# Altium schematic sheet Sheet5_PowerSupply&Connecters.SchDoc: Power Supply & Connectors
size A4; DrawnBy: D.N.Nhuan; Revision: NT-1.1; SheetNumber: 5; SheetTotal: 5
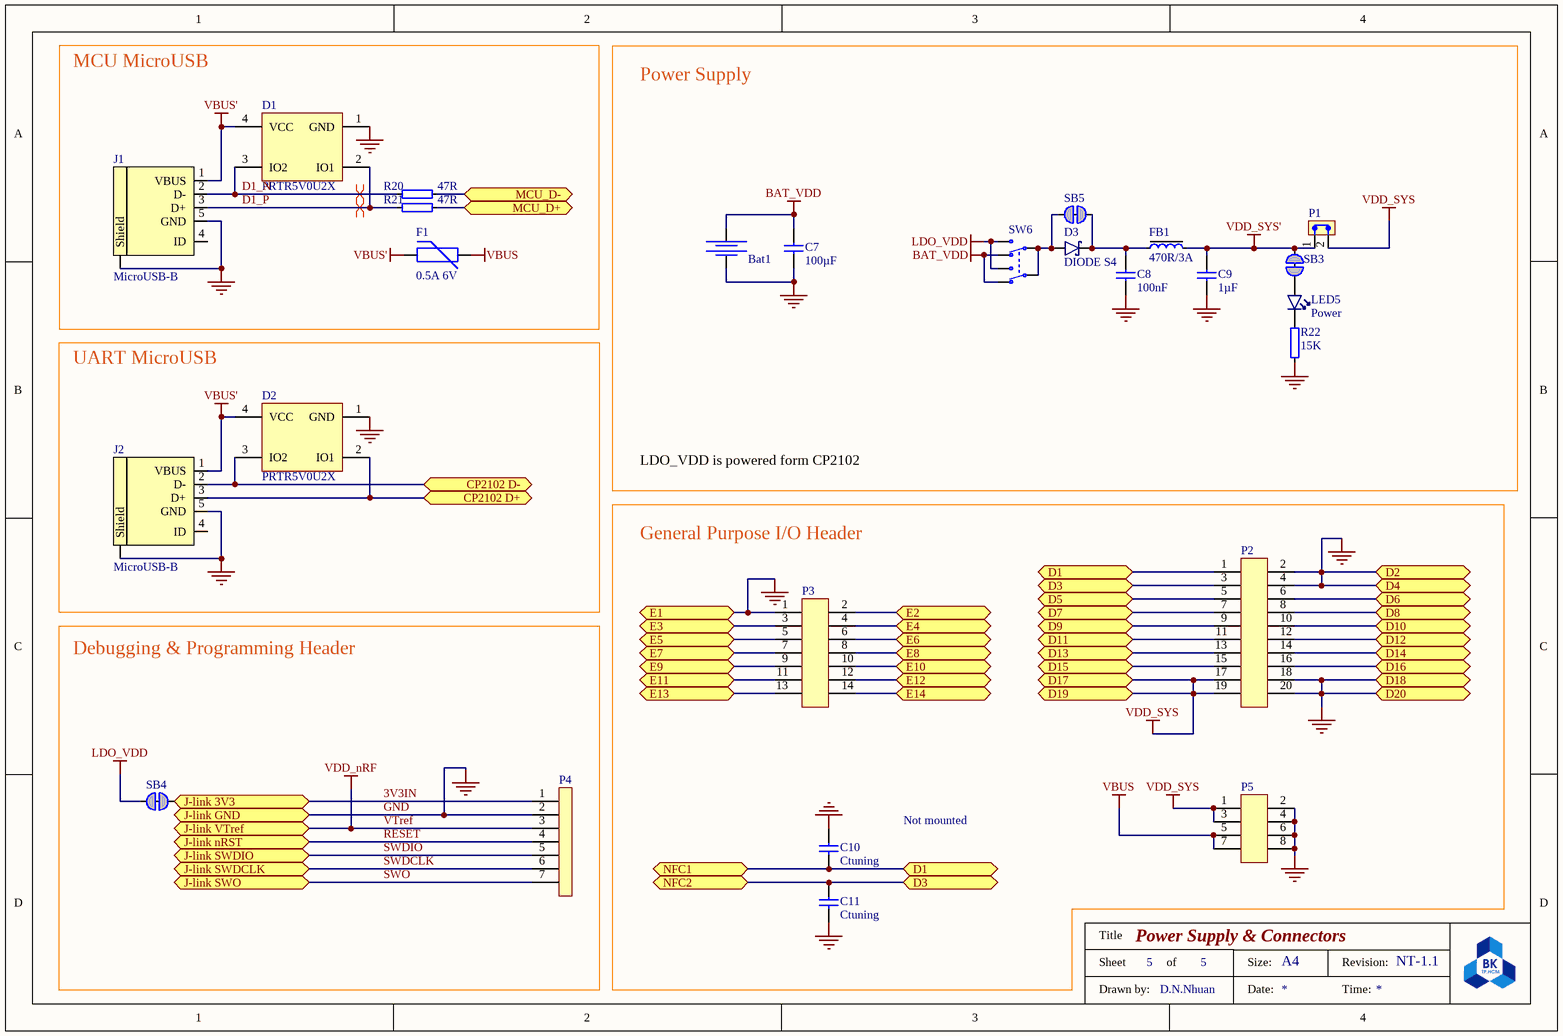
[diagram p0: Sheet5_PowerSupply&Connecters.SchDoc]

## Parts
Bat1  Bat Holder CR2032  [CR2032_HOLDER]  (value not drawn)
C7  100µF  [1210_Imperial]
C8  100nF  [0402 imperial]
C9  1µF  [0603_Imperial]
C10  Ctuning  [0402 imperial]
C11  Ctuning  [0402 imperial]
D1  PRTR5V0U2X  [SOT190P230X110-4L]
D2  PRTR5V0U2X  [SOT190P230X110-4L]
D3  DIODE S4  [SOD-123]
F1  0.5A 6V  [0805_Imperial]
FB1  470R/3A  [0603_Imperial]
J1  MicroUSB-B  [USB-Micro-B-RA-SMD-PiP]
J2  MicroUSB-B  [USB-Micro-B-RA-SMD-PiP]
LED5  Power  [LED_0603]
P1  2p, 2.54mm  [CONN2.54MM2P]  (value not drawn)
P2  10x2, 2.54mm  [CONN2.54MM10X2]  (value not drawn)
P3  2x7p, 2.54mm  [CONN2.54MM7PX2]  (value not drawn)
P4  Debug&Programming  [CONN2.54MM7P]  (value not drawn)
P5  2x4p, 2.54mm  [CONN2.54MM2X4]  (value not drawn)
R20  47R  [0402 imperial]
R21  47R  [0402 imperial]
R22  15K  [0402 imperial]
SB3  Solderbridge  [Solderbridge_Shorted]  (value not drawn)  (net tie, no BOM)
SB4  Solderbridge  [Solderbridge_Shorted]  (value not drawn)  (net tie, no BOM)
SB5  Solderbridge  [Solderbridge_Shorted]  (value not drawn)  (net tie, no BOM)
SW6  MSS22D18  [MSS22D18SMD]  (value not drawn)

## Blocks framed on the sheet
MCU MicroUSB: D1 F1 J1 R20 R21
Power Supply: Bat1 C7-C9 D3 FB1 LED5 P1 R22 SB3 SB5 SW6
UART MicroUSB: D2 J2
General Purpose I/O Header: C10 C11 P2 P3 P5
Debugging & Programming Header: P4 SB4

## Ports
CP2102 D+, CP2102 D-, D1, D2, D3, D4, D5, D6, D7, D8, D9, D10, D11, D12, D13, D14, D15, D16, D17, D18, D19, D20, E1, E2, E3, E4, E5, E6, E7, E8, E9, E10, E11, E12, E13, E14, J-link 3V3, J-link GND, J-link nRST, J-link SWDCLK, J-link SWDIO, J-link SWO, J-link VTref, MCU_D+, MCU_D-, NFC1, NFC2

## Nets
BAT_VDD: Bat1.1 C7.2 SW6.3(N.C-1) SW6.6(N.C-2)
GND: Bat1.2 C7.1 C8.1 C9.1 C10.2 C11.1 D1.1(GND) D2.1(GND) J1.5(GND) J1.6(Shield) J2.5(GND) J2.6(Shield) P2.2 P2.4 P2.18 P2.20 P3.1 P4.2 P5.2 P5.4 P5.6 P5.8 R22.1 ; port J-link GND, port D2, port D4, port D18, port D20, port E1
LDO_VDD: SB4.1 SW6.1(N.O-1) SW6.4(N.O-2)
VBUS: F1.2 P5.5 P5.7
VBUS': D1.4(VCC) D2.4(VCC) F1.1 J1.1(VBUS) J2.1(VBUS)
VDD_SYS: P1.2 P2.17 P2.19 P5.1 P5.3 ; port D17, port D19
VDD_SYS': C9.2 FB1.2 P1.1 SB3.1
VTref: P4.3 ; port J-link VTref  [also labelled VDD_nRF]
3V3IN: P4.1 SB4.2 ; port J-link 3V3
CP2102 D+: D2.2(IO1) J2.3(D+) ; port CP2102 D+
CP2102 D-: D2.3(IO2) J2.2(D-) ; port CP2102 D-
D1: C10.1 P2.1 ; port D1, port NFC1
D1_N: D1.3(IO2) J1.2(D-) R20.1
D1_P: D1.2(IO1) J1.3(D+) R21.1
D3: C11.2 P2.3 ; port D3, port NFC2
D5: P2.5 ; port D5
D6: P2.6 ; port D6
D7: P2.7 ; port D7
D8: P2.8 ; port D8
D9: P2.9 ; port D9
D10: P2.10 ; port D10
D11: P2.11 ; port D11
D12: P2.12 ; port D12
D13: P2.13 ; port D13
D14: P2.14 ; port D14
D15: P2.15 ; port D15
D16: P2.16 ; port D16
E2: P3.2 ; port E2
E3: P3.3 ; port E3
E4: P3.4 ; port E4
E5: P3.5 ; port E5
E6: P3.6 ; port E6
E7: P3.7 ; port E7
E8: P3.8 ; port E8
E9: P3.9 ; port E9
E10: P3.10 ; port E10
E11: P3.11 ; port E11
E12: P3.12 ; port E12
E13: P3.13 ; port E13
E14: P3.14 ; port E14
MCU_D+: R21.2 ; port MCU_D+
MCU_D-: R20.2 ; port MCU_D-
RESET: P4.4 ; port J-link nRST
SWDCLK: P4.6 ; port J-link SWDCLK
SWDIO: P4.5 ; port J-link SWDIO
SWO: P4.7 ; port J-link SWO
NetC8_2: C8.2 D3.1(C) FB1.1 SB5.1
NetD3_2: D3.2(A) SB5.2 SW6.2(COM-1) SW6.5(COM-2)
NetLED5_1: LED5.1(C) R22.2
NetLED5_2: LED5.2(A) SB3.2

Not connected (* = marked no-connect by the designer): J1 4(ID); J2 4(ID)

## Layout directives
differential pair: D1_N, D1_P

## Notes on the sheet
- LDO_VDD is powered form CP2102
- Not mounted
- Title
- Sheet
- of
- Size:
- A4
- Revision:
- Drawn by:
- Date:
- Time:

## Library data of the parts
Bat1 = Bat Holder CR2032: Bat Holder CR2032 SMD; Note: Bat Holder CR2032
C7-C11 = Capacitor: Genaral Schematic; Tolerance: ±5%; Suppiler: *; Link of Supplier: *; Manufacturer: *; Manufacturer Part Number: *; Footprint: 0402
  C7: Value: 100µF
  C8: Value: 100nF
  C9: Value: 1µF
  C10 C11: Value: Ctuning
D1 D2 = PRTR5V0U2X: Ultra low capacitance double rail-to-rail ESD protection diode; Manufacturer: NXP; 2nd source part number: 152-4157; Artikkelnr Noca: 10069015; Artikkelnr Simpro: N.A.; Part Number: PRTR5V0U2X; Manufacturer Part Number: PRTR5V0U2X; Datasheet: http://www.farnell.com/datasheets/109718.pdf; LatestRevisionDate: 2012-06-11; Publisher: Nordic Semiconductor; Published: 2012-06-11; Value: PRTR5V0U2X; Note: *; Supplier: Digi-Key; Supplier part number: 568-4140-1-ND; 2nd source Supplier: Farnell; Footprint Doc: SOT-143B
D3 = Diode Schottky: Value: DIODE S4; Note: *
F1 = Fuse: Fuse Fuse Fuse; Value: 0.5A 6V
FB1 = Ferrite Bead: General FB; Footprint: 0603; Value: 470R/3A
J1 J2 = MiniUSB-AB-SMT: MicroUSB-B-SMT; Manufacturer: Allen Creations Corp.; Manufacturer Part Number: AJU55-BS2111-L; 2nd source part number: 609-4616-1-ND; Part number IPS: 00000007790; Artikkelnr Noca: 55029020; Artikkelnr Simpro: N.A.; Part Number: USB-Micro-B-RA-SMD-PiP; Datasheet: \\hizz\pro\app9717\Datasheet\connectores\Allen Creations Corp\AJU-211.pdf; Footprint Doc: USB-Micro-B-RA-SMD-PiP; LatestRevisionDate: 2016-04-21; Pin Count: 5; Publisher: Nordic Semiconductor; Published: 2014-10-07; Value: MicroUSB-B; Note: *; Supplier: Cabcon; Supplier part number: AJU55-BS2111-L; 2nd source Supplier: Digi-Key
LED5 = LED: General Schematic; Color: Green; Footprint: 0603; Indicate: Power
P1 = Headerx 2: Value: 2p, 2.54mm
P2 = Header 10x2: General Schematic; Value: 10x2, 2.54mm
P3 = Header 7x2: General Schematic; Value: 2x7p, 2.54mm
P4 = Header 7: General Schematic; Value: Debug&Programming
P5 = Header 4x2: General Schematic; Value: 2x4p, 2.54mm
R20-R22 = Resistor: General Schematic; Tolerance: ±5%; Supplier: *; Link of Supplier: *; Footprint: 0402
  R20 R21: Value: 47R
  R22: Value: 15K
SB3-SB5 = Solderbridge Shorted: Shorted Solderbridge; Artikkelnr Noca: N.A.; Part Number: Solderbridge Shorted; Manufacturer: *; Manufacturer Part Number: *; Datasheet: *; LatestRevisionDate: 2012-08-07; Pin Count: 2; Publisher: Nordic Semiconductor; Published: 2012-08-07; Value: Solderbridge; Note: *; Supplier: *; Supplier part number: *; 2nd source Supplier: *; 2nd source part number: *; Footprint Doc: Solderbridge_Shorted; Artikkelnr Simpro: N.A.
SW6 = MSS22D18: Slide Switch DPDT; Part Number: *; Manufacturer Part Number: *; Pin Count: 6; Value: MSS22D18; Note: *